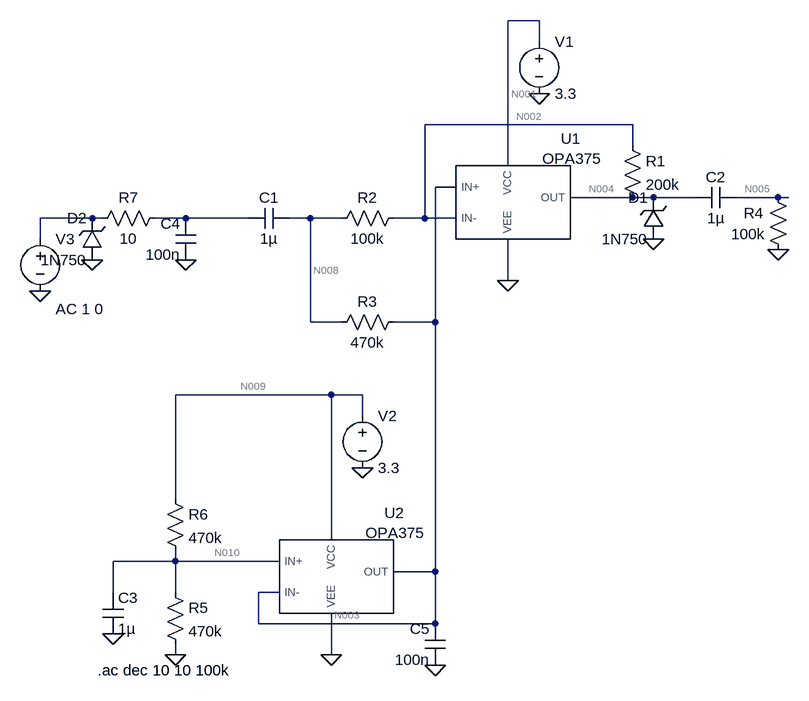
[diagram p0: schematic single_rail_amp.asc]
single_rail_amp.asc, the LTspice schematic file:
Version 4
SHEET 1 880 872
WIRE 208 -144 160 -144
WIRE 208 -112 208 -144
WIRE 352 16 32 16
WIRE 352 48 352 16
WIRE 160 80 160 -144
WIRE 80 112 48 112
WIRE 352 128 256 128
WIRE 384 128 352 128
WIRE 448 128 384 128
WIRE 576 128 512 128
WIRE 592 128 576 128
WIRE -480 160 -560 160
WIRE -464 160 -480 160
WIRE -336 160 -384 160
WIRE -240 160 -336 160
WIRE -144 160 -176 160
WIRE -96 160 -144 160
WIRE 32 160 32 16
WIRE 32 160 -16 160
WIRE 80 160 32 160
WIRE -560 192 -560 160
WIRE 160 256 160 192
WIRE -144 320 -144 160
WIRE -96 320 -144 320
WIRE 48 320 48 112
WIRE 48 320 -16 320
WIRE -112 432 -352 432
WIRE -64 432 -112 432
WIRE -64 464 -64 432
WIRE -352 592 -352 432
WIRE -112 656 -112 432
WIRE -352 688 -352 672
WIRE -352 688 -448 688
WIRE -192 688 -352 688
WIRE 48 704 48 320
WIRE 48 704 -16 704
WIRE -448 736 -448 688
WIRE -352 736 -352 688
WIRE -192 736 -224 736
WIRE -224 784 -224 736
WIRE 48 784 48 704
WIRE 48 784 -224 784
WIRE -352 832 -352 816
WIRE -112 832 -112 768
FLAG 160 256 0
FLAG 208 -32 0
FLAG -112 832 0
FLAG -64 544 0
FLAG -448 800 0
FLAG -352 832 0
FLAG -560 272 0
FLAG 576 208 0
FLAG -336 224 0
FLAG 48 848 0
FLAG 384 192 0
FLAG -480 224 0
SYMBOL OPA375 144 144 R0
SYMATTR InstName U1
SYMBOL voltage 208 -128 R0
WINDOW 123 0 0 Left 0
WINDOW 39 0 0 Left 0
SYMATTR InstName V1
SYMATTR Value 3.3
SYMBOL res 336 32 R0
SYMATTR InstName R1
SYMATTR Value 200k
SYMBOL res 0 144 R90
WINDOW 0 0 56 VBottom 2
WINDOW 3 32 56 VTop 2
SYMATTR InstName R2
SYMATTR Value 100k
SYMBOL cap -176 144 R90
WINDOW 0 0 32 VBottom 2
WINDOW 3 32 32 VTop 2
SYMATTR InstName C1
SYMATTR Value 1µ
SYMBOL res 0 304 R90
WINDOW 0 0 56 VBottom 2
WINDOW 3 32 56 VTop 2
SYMATTR InstName R3
SYMATTR Value 470k
SYMBOL OPA375 -128 720 R0
SYMATTR InstName U2
SYMBOL voltage -64 448 R0
WINDOW 123 0 0 Left 0
WINDOW 39 0 0 Left 0
SYMATTR InstName V2
SYMATTR Value 3.3
SYMBOL res -368 720 R0
SYMATTR InstName R5
SYMATTR Value 470k
SYMBOL res -368 576 R0
SYMATTR InstName R6
SYMATTR Value 470k
SYMBOL cap -464 736 R0
SYMATTR InstName C3
SYMATTR Value 1µ
SYMBOL voltage -560 176 R0
WINDOW 123 24 124 Left 2
WINDOW 39 0 0 Left 0
SYMATTR Value2 AC 1 0
SYMATTR InstName V3
SYMATTR Value ""
SYMBOL cap 512 112 R90
WINDOW 0 0 32 VBottom 2
WINDOW 3 32 32 VTop 2
SYMATTR InstName C2
SYMATTR Value 1µ
SYMBOL res 592 224 R180
WINDOW 0 38 72 Left 2
WINDOW 3 36 40 Left 2
SYMATTR InstName R4
SYMATTR Value 100k
SYMBOL res -480 176 R270
WINDOW 0 32 56 VTop 2
WINDOW 3 0 56 VBottom 2
SYMATTR InstName R7
SYMATTR Value 10
SYMBOL cap -320 224 R180
WINDOW 0 24 56 Left 2
WINDOW 3 24 8 Left 2
SYMATTR InstName C4
SYMATTR Value 100n
SYMBOL cap 64 848 R180
WINDOW 0 24 56 Left 2
WINDOW 3 24 8 Left 2
SYMATTR InstName C5
SYMATTR Value 100n
SYMBOL zener 400 192 R180
WINDOW 0 24 64 Left 2
WINDOW 3 24 0 Left 2
SYMATTR InstName D1
SYMATTR Value 1N750
SYMBOL zener -464 224 R180
WINDOW 0 24 64 Left 2
WINDOW 3 24 0 Left 2
SYMATTR InstName D2
SYMATTR Value 1N750
TEXT -472 856 Left 2 !.ac dec 10 10 100k

The netlist it stands for:
* single_rail_amp.asc
XU1 N003 N002 N001 0 N004 OPA375  ; pins IN+ IN- VCC VEE OUT
V1 N001 0 3.3
R1 N002 N004 200k
R2 N002 N008 100k
C1 N008 N007 1µ
R3 N003 N008 470k
XU2 N010 N003 N009 0 N003 OPA375  ; pins IN+ IN- VCC VEE OUT
V2 N009 0 3.3
R5 N010 0 470k
R6 N009 N010 470k
C3 N010 0 1µ
V3 N006 0 AC 1 0
C2 N005 N004 1µ
R4 0 N005 100k
R7 N006 N007 10
C4 0 N007 100n
C5 0 N003 100n
D1 0 N004 1N750
D2 0 N006 1N750
.model D D
.lib standard.dio
.ac dec 10 10 100k
.lib C:\Users\mattr\Dokumenty\mateuszrjzr_stm\matiHome\simulation\OPA2375\fixed_models\opa375.lib
.backanno
.end

* Results of the author's LTspice run, read from the files saved beside the schematic
* Operating Point, zero values left out:
*   V(n004) = 1.65 V
*   V(n001) = 3.3 V
*   V(n002) = 1.65 V
*   V(n003) = 1.65 V
*   V(n008) = 1.65 V
*   V(n009) = 3.3 V
*   V(n010) = 1.65 V
*   I(D1) = -748.6 nA
*   I(R6) = 3.511 µA
*   I(R5) = 3.511 µA
*   I(R3) = -236 pA
*   I(R2) = 236 pA
*   I(R1) = -236 pA
*   I(V2) = -853.5 µA
*   I(V1) = -850.7 µA
*   Ix(u1:IN+) = 9.992 pA
*   Ix(u1:VCC) = 850.7 µA
*   Ix(u1:VEE) = -850 µA
*   Ix(u1:OUT) = -748.8 nA
*   Ix(u2:IN+) = 9.925 pA
*   Ix(u2:VCC) = 850 µA
*   Ix(u2:VEE) = -850 µA
*   Ix(u2:OUT) = 226 pA
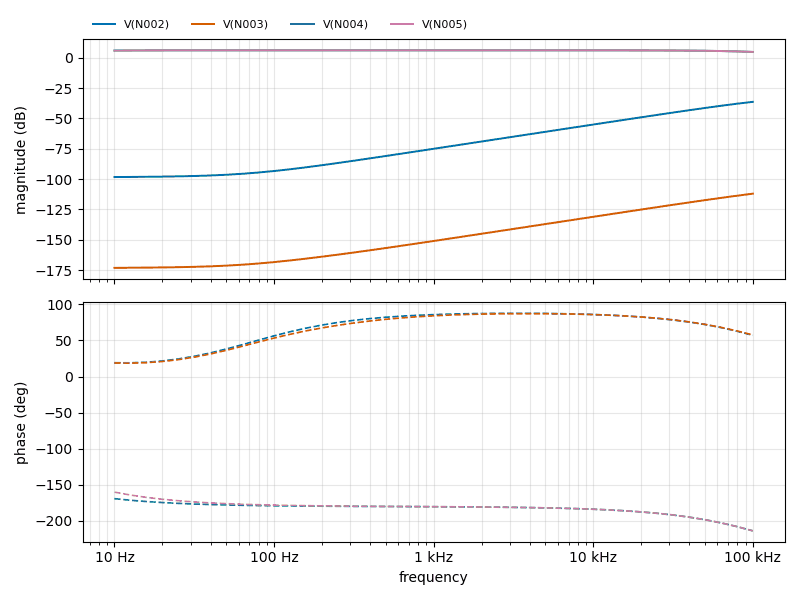
[diagram p1: AC Analysis of single_rail_amp.asc, plotted from the saved traces]
* AC Analysis, 1 run:
*   V(N002): -98.32 dB at 10 Hz, -36.39 dB at 100 kHz, peak -36.39 dB at 100 kHz, 3 dB below the peak at 65.27 kHz
*   V(N003): -173.08 dB at 10 Hz, -112.00 dB at 100 kHz, peak -112.00 dB at 100 kHz, 3 dB below the peak at 67.05 kHz
*   V(N004): 5.86 dB at 10 Hz, 4.69 dB at 100 kHz, peak 6.02 dB at 631 Hz
*   V(N005): 5.75 dB at 10 Hz, 4.69 dB at 100 kHz, peak 6.02 dB at 631 Hz